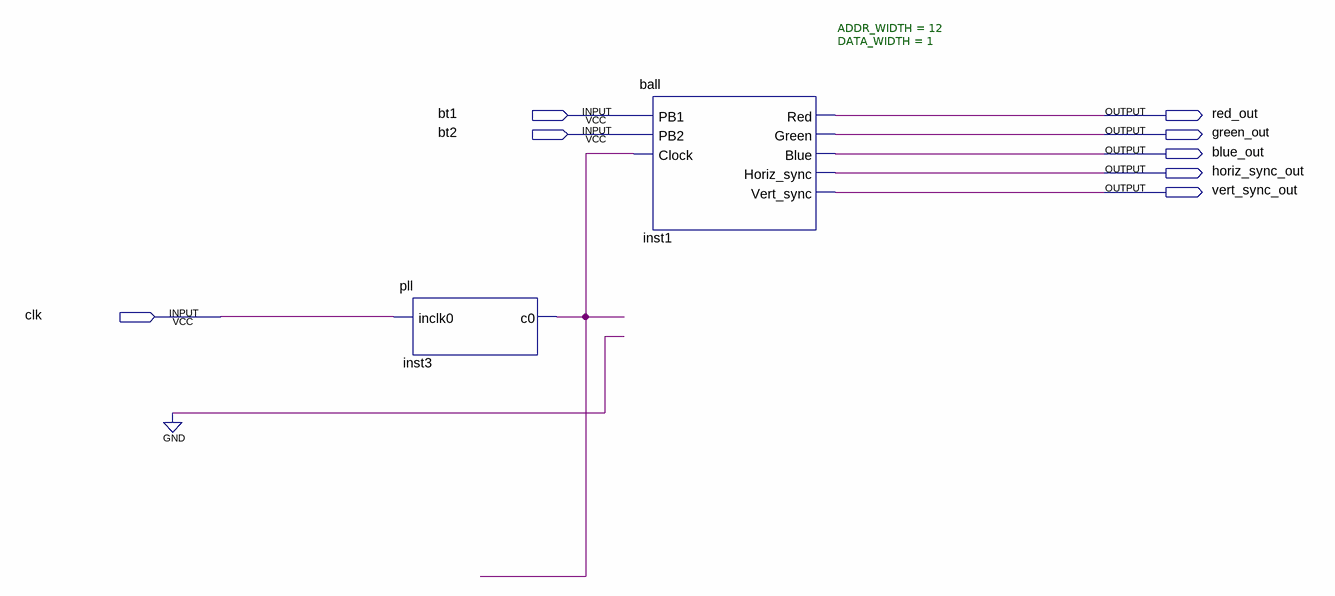
[diagram p0: schematic sheet]
// Quartus schematic ActualBouncingBall.bdf as structural Verilog: 2 symbols, 8 pins
module ActualBouncingBall (
  input  bt1,
  input  bt2,
  input  clk,
  output red_out,
  output green_out,
  output blue_out,
  output horiz_sync_out,
  output vert_sync_out
);

  wire inst3_c0;

  pll inst3 (.inclk0(clk), .c0(inst3_c0));
  ball #(.ADDR_WIDTH(12), .DATA_WIDTH(1)) inst1 (
    .PB1(bt1), .PB2(bt2), .Clock(inst3_c0), .Red(red_out), .Green(green_out), .Blue(blue_out),
    .Horiz_sync(horiz_sync_out), .Vert_sync(vert_sync_out));
endmodule
